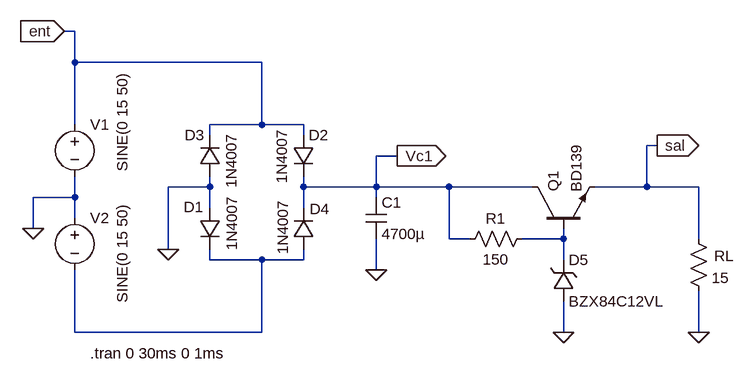
[diagram p0: schematic E5-regulacion-transistor.asc]
E5-regulacion-transistor.asc, the LTspice schematic file:
Version 4
SHEET 1 932 680
WIRE -528 -80 -544 -80
WIRE -528 -32 -528 -80
WIRE -240 -32 -528 -32
WIRE -528 64 -528 -32
WIRE -240 64 -240 -32
WIRE -240 64 -320 64
WIRE -176 64 -240 64
WIRE -320 80 -320 64
WIRE -176 80 -176 64
WIRE 368 96 352 96
WIRE -32 112 -64 112
WIRE -320 160 -320 144
WIRE -320 160 -384 160
WIRE -176 160 -176 144
WIRE -64 160 -64 112
WIRE -64 160 -176 160
WIRE 48 160 -64 160
WIRE 176 160 48 160
WIRE 352 160 352 96
WIRE 352 160 272 160
WIRE 432 160 352 160
WIRE -528 176 -528 144
WIRE -528 176 -592 176
WIRE -64 176 -64 160
WIRE -320 192 -320 160
WIRE -176 192 -176 160
WIRE -528 208 -528 176
WIRE -592 224 -592 176
WIRE 48 240 48 160
WIRE 80 240 48 240
WIRE 224 240 224 224
WIRE 224 240 160 240
WIRE 432 240 432 160
WIRE -384 256 -384 160
WIRE -320 272 -320 256
WIRE -240 272 -320 272
WIRE -176 272 -176 256
WIRE -176 272 -240 272
WIRE 224 272 224 240
WIRE -64 288 -64 240
WIRE -528 384 -528 288
WIRE -240 384 -240 272
WIRE -240 384 -528 384
WIRE 224 384 224 336
WIRE 432 384 432 320
FLAG -64 288 0
FLAG 432 384 0
FLAG -544 -80 ent
IOPIN -544 -80 In
FLAG 368 96 sal
IOPIN 368 96 Out
FLAG -384 256 0
FLAG -592 224 0
FLAG 224 384 0
FLAG -32 112 Vc1
IOPIN -32 112 Out
SYMBOL voltage -528 48 R0
WINDOW 3 73 -64 VRight 2
WINDOW 123 -22 138 VLeft 2
WINDOW 39 0 0 Left 0
SYMATTR Value SINE(0 15 50)
SYMATTR InstName V1
SYMBOL cap -80 176 R0
SYMATTR InstName C1
SYMATTR Value 4700µ
SYMBOL res 416 224 R0
WINDOW 0 40 42 Left 2
SYMATTR InstName RL
SYMATTR Value 15
SYMBOL diode -336 192 R0
WINDOW 0 -24 -1 Left 2
WINDOW 3 50 -19 VRight 2
SYMATTR InstName D1
SYMATTR Value 1N4007
SYMBOL diode -192 80 R0
WINDOW 3 -17 -10 VRight 2
SYMATTR Value 1N4007
SYMATTR InstName D2
SYMBOL diode -304 144 R180
WINDOW 0 24 64 Left 2
WINDOW 3 -17 -18 VRight 2
SYMATTR InstName D3
SYMATTR Value 1N4007
SYMBOL diode -160 256 R180
WINDOW 0 -24 62 Left 2
WINDOW 3 48 -8 VRight 2
SYMATTR InstName D4
SYMATTR Value 1N4007
SYMBOL voltage -528 192 R0
WINDOW 3 73 147 VLeft 2
WINDOW 123 -22 138 VLeft 2
WINDOW 39 0 0 Left 0
SYMATTR Value SINE(0 15 50)
SYMATTR InstName V2
SYMBOL res 176 224 R90
WINDOW 0 0 56 VBottom 2
WINDOW 3 32 56 VTop 2
SYMATTR InstName R1
SYMATTR Value 150
SYMBOL zener 208 336 M180
WINDOW 0 24 64 Left 2
WINDOW 3 24 0 Left 2
SYMATTR InstName D5
SYMATTR Value BZX84C12VL
SYMATTR Description Diode
SYMATTR Type diode
SYMBOL npn 176 224 R270
SYMATTR InstName Q1
SYMATTR Value BD139
TEXT -504 416 Left 2 !.tran 0 30ms 0 1ms

The netlist it stands for:
* E5-regulacion-transistor.asc
V1 ent 0 SINE(0 15 50)
C1 Vc1 0 4700µ
RL sal 0 15
D1 0 N002 1N4007
D2 ent Vc1 1N4007
D3 0 ent 1N4007
D4 N002 Vc1 1N4007
V2 0 N002 SINE(0 15 50)
R1 N001 Vc1 150
D5 0 N001 BZX84C12VL
Q1 Vc1 N001 sal 0 BD139
.model D D
.lib standard.dio
.model NPN NPN
.model PNP PNP
.lib standard.bjt
.tran 0 30ms 0 1ms
.backanno
.end